# Altium schematic sheet pca10040_sheet3_buttons_and_leds.SchDoc: PCA10040 - Buttons and LEDs
size A4; Revision: 1.1.1; SheetNumber: 3; SheetTotal: 5; DrawnBy: KJP; ProjectNumber: 4397; PCBRevision: 0071KJP; DocumentSize: A4; PCAName: PCA10040; PCBNumber: 400150; ProjectName: Quark
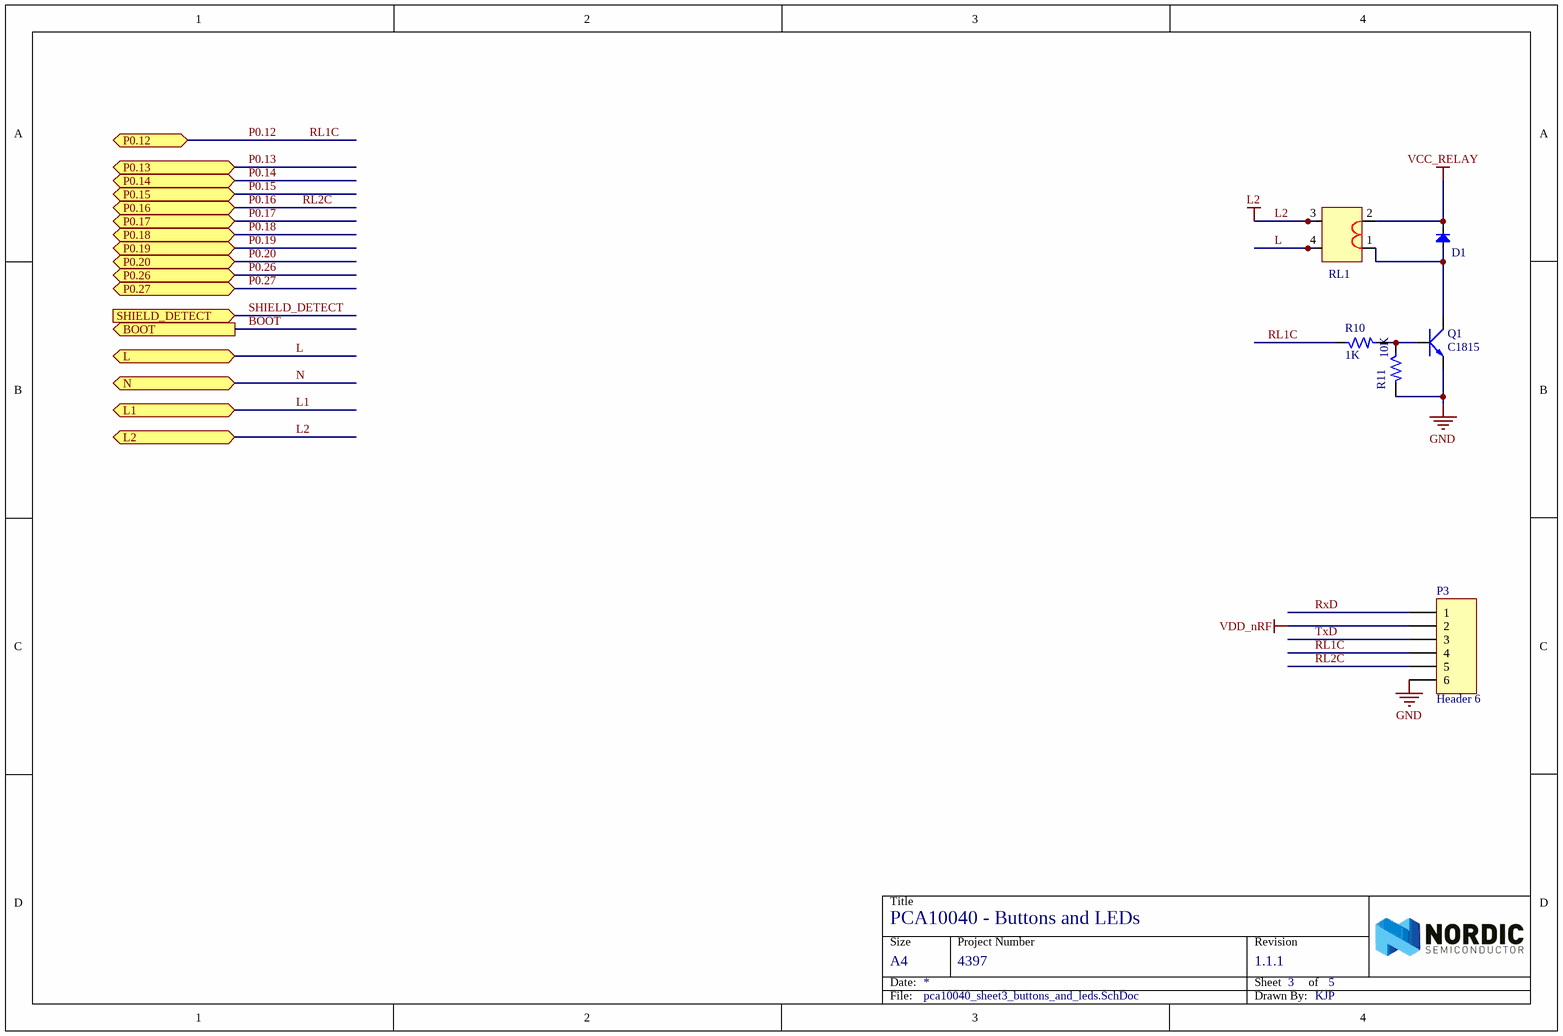
[diagram p0: pca10040_sheet3_buttons_and_leds.SchDoc]

## Parts
D1  Diode SMD  [DIO-SMD-123]  (value not drawn)
P3  Header 6  [HDR1X6]
Q1  C1815  [SOT23B]
R10  1K  [0603]
R11  10K  [0603]
RL1  Component_1  [AZ7705]  (value not drawn)

## Ports
BOOT (out), L1 (bidir), L2 (bidir), L (bidir), N (bidir), P0.12 (bidir), P0.13 (bidir), P0.14 (bidir), P0.15 (bidir), P0.16 (bidir), P0.17 (bidir), P0.18 (bidir), P0.19 (bidir), P0.20 (bidir), P0.26 (bidir), P0.27 (bidir), SHIELD_DETECT (in)

## Nets
GND: P3.6 Q1.3(E) R11.2
L2: RL1.3 ; port L2
VCC_RELAY: D1.2(K) RL1.2
VDD_nRF: P3.2
BOOT: port BOOT
L: RL1.4 ; port L
L1: port L1
N: port N
P0.12: P3.4 R10.1 ; port P0.12  [also labelled RL1C]
P0.13: port P0.13
P0.14: port P0.14
P0.15: port P0.15
P0.16: P3.5 ; port P0.16  [also labelled RL2C]
P0.17: port P0.17
P0.18: port P0.18
P0.19: port P0.19
P0.20: port P0.20
P0.26: port P0.26
P0.27: port P0.27
RxD: P3.1
SHIELD_DETECT: port SHIELD_DETECT
TxD: P3.3
NetD1_1: D1.1(A) Q1.2(C) RL1.1
NetQ1_1: Q1.1(B) R10.2 R11.1

## Notes on the sheet
- Title
- Size
- Date:
- Project Number
- Sheet         of
- Revision
- File:
- Drawn By:

## Library data of the parts
D1 = Diode SMD: Default Diode; Code - JEDEC: DO-214-AB; Value: 1N5007; Published: 8-Jun-2000; Revision: July-2002: Re-released for DXP Platform.; Publisher: Altium Limited
P3 = Header 6: Header, 6-Pin; LatestRevisionDate: 17-Jul-2002; LatestRevisionNote: Re-released for DXP Platform.; Publisher: Altium Limited
Q1 = C1815: NPN 600mW, ECB; Value: C1815
R10 R11 = R: Resistor 1/4W; Value: R1/4W - 1K